# EAGLE design sensor-LCD-shield (EAGLE 5.06)
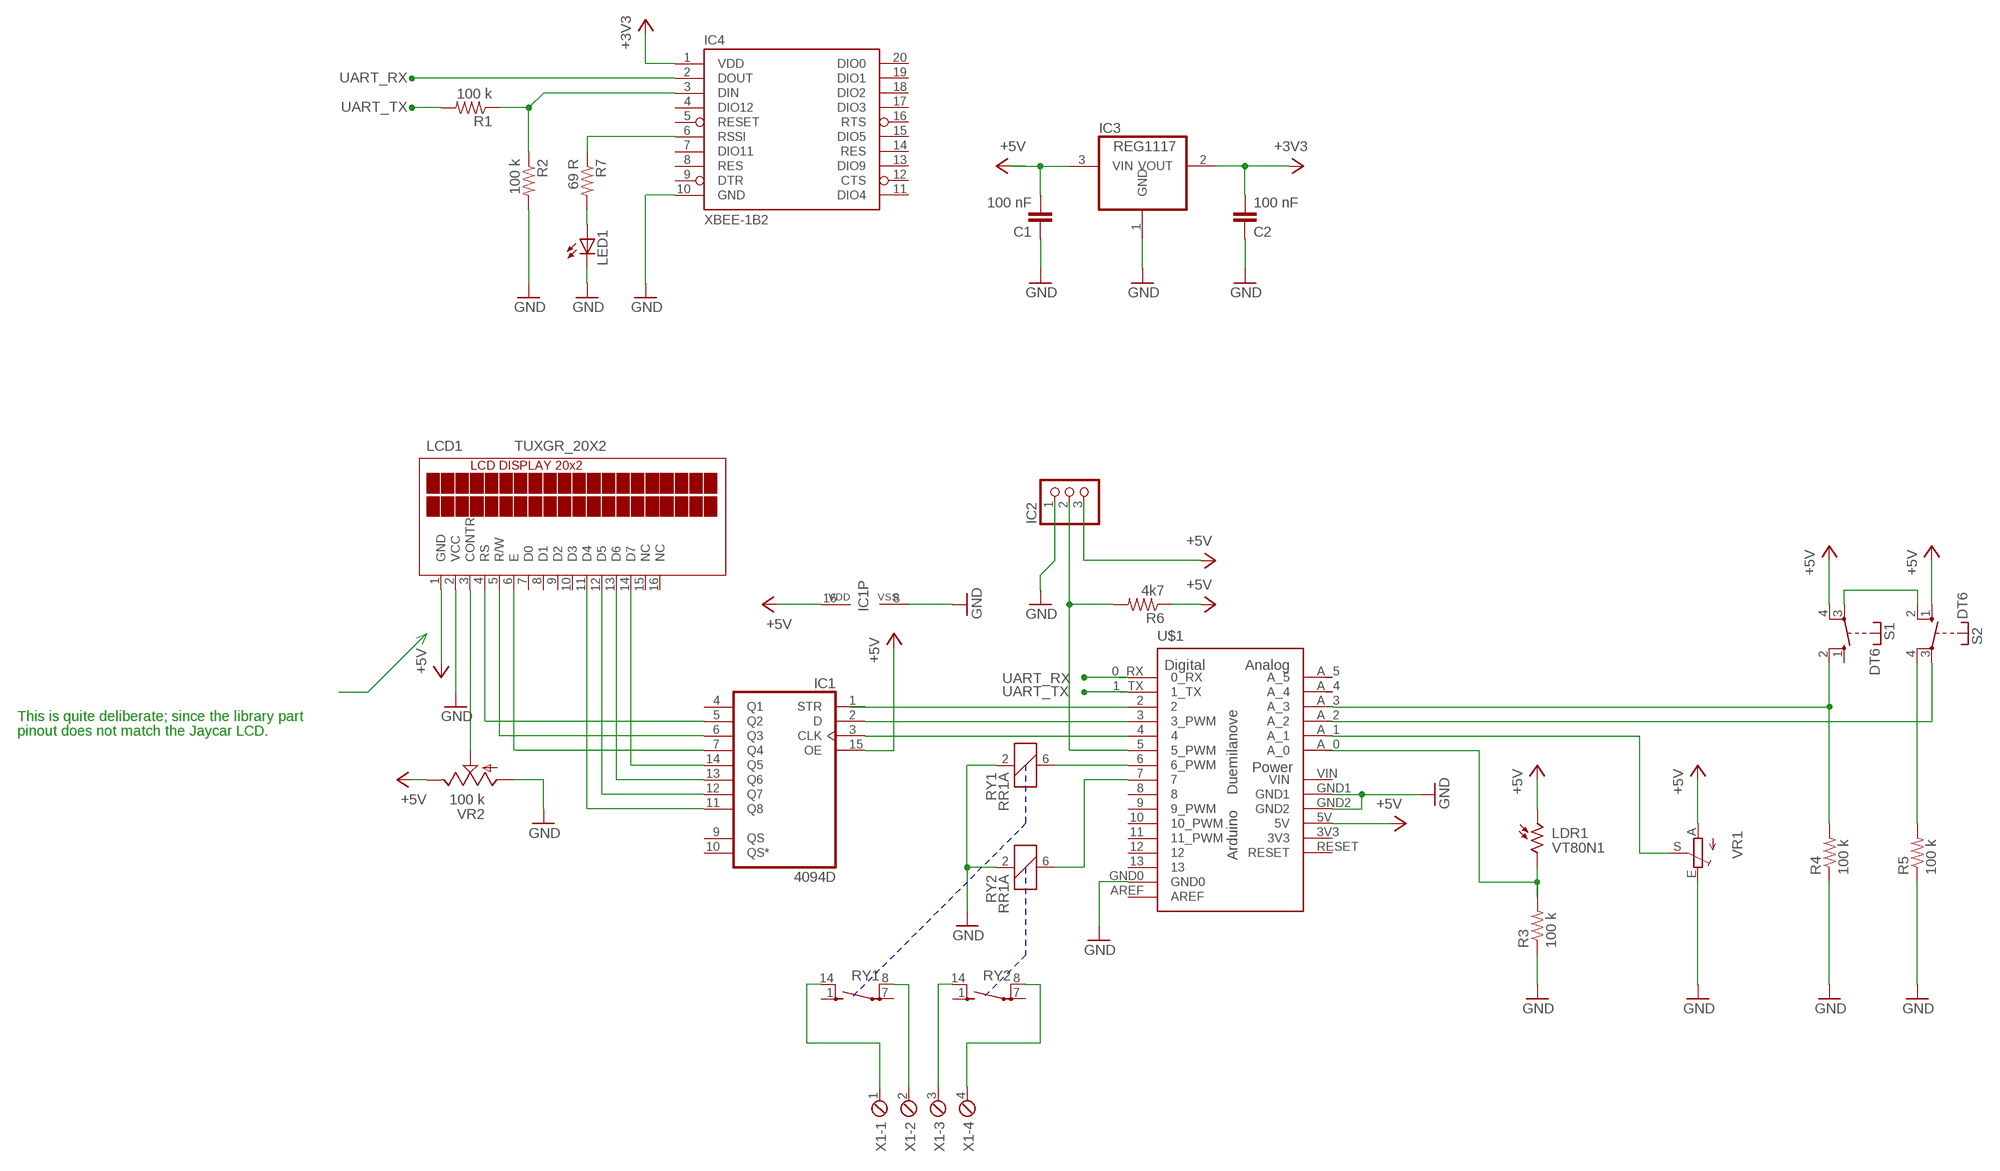
[diagram p0: schematic, sheet 1]

## Parts
C1  100 nF  C-EUC0805  [C0805]
C2  100 nF  C-EUC0805  [C0805]
IC1  4094D  [SO16]
IC2  PINHD-1X3  [1X03]
IC3  REG1117  [SOT223]
IC4  XBEE-1B2  [XBEE-SILK]
LCD1  TUXGR_20X2  [TUXGR_20X2]
LDR1  VT80N1  [VT800]
LED1  LED3MM  [LED3MM]
R1  100 k  R-US_R0805  [R0805]
R2  100 k  R-US_R0805  [R0805]
R3  100 k  R-US_R0805  [R0805]
R4  100 k  R-US_R0805  [R0805]
R5  100 k  R-US_R0805  [R0805]
R6  4k7  R-US_R0805  [R0805]
R7  69 R  R-US_R0805  [R0805]
RY1  RR1A  [RR1A]
RY2  RR1A  [RR1A]
S1  DT6  [DT6]
S2  DT6  [DT6]
U$1  ARDUINO-USBLONG_PADS_TEXT  [SHIELD]
VR1  TRIM_EU-B25V  [B25V]
VR2  100 k  TRIM_US-S64W  [S64W]
X1  MPT4  [4POL254]

## Nets
+3V3: C2.2 IC3.2(VOUT) IC4.1(VDD)
+5V: C1.2 IC1.15(OE) IC1.16(VDD) IC2.3 IC3.3(VIN) LCD1.1(GND) LDR1.1 R6.1 S1.4(P) S2.1(S) U$1.5V VR1.A VR2.E
GND: C1.1 C2.1 IC1.8(VSS) IC2.1 IC3.1(GND) IC4.10(GND) LCD1.2(VCC) LED1.K(C) R2.2 R3.1 R4.1 R5.1 RY1.2 RY2.2 U$1.GND0 U$1.GND1 U$1.GND2 VR1.E VR2.A
N$1: IC1.1(STR) U$1.2
N$2: IC1.3(CLK) U$1.4
N$3: IC1.2(D) U$1.3(3_PWM)
N$4: RY1.6 U$1.6(6_PWM)
N$5: RY2.6 U$1.7
N$6: RY1.14(2:S) X1.1
N$7: RY1.8(2:P) X1.2
N$9: RY2.8(2:P) X1.4
N$10: R4.2 S1.2(S) U$1.A_3
N$11: U$1.A_1 VR1.S
N$12: S2.3(P) U$1.A_2
N$13: LDR1.2 R3.2 U$1.A_0
N$14: IC1.11(Q8) LCD1.11(D4)
N$15: IC1.12(Q7) LCD1.12(D5)
N$16: IC1.13(Q6) LCD1.13(D6)
N$17: IC1.14(Q5) LCD1.14(D7)
N$18: IC1.5(Q2) LCD1.4(RS)
N$19: IC1.6(Q3) LCD1.5(R/W)
N$20: IC1.7(Q4) LCD1.6(E)
N$21: LCD1.3(CONTR) VR2.S
N$22: IC2.2 R6.2 U$1.5(5_PWM)
N$23: IC4.6(RSSI) R7.1
N$24: LED1.A R7.2
N$25: R5.2 S2.4(P)
N$26: IC4.3(DIN) R1.1 R2.1
N$27: S1.3(P) S2.2(S)
N$30: RY2.14(2:S) X1.3
UART_RX: IC4.2(DOUT) U$1.0_RX
UART_TX: R1.2 U$1.1_TX
Unconnected: IC1.4(Q1) IC1.9(QS) IC1.10(QS*) IC4.4(DIO12) IC4.5(RESET) IC4.7(DIO11) IC4.8(RES) IC4.9(DTR) IC4.11(DIO4) IC4.12(CTS) IC4.13(DIO9) IC4.14(RES) IC4.15(DIO5) IC4.16(RTS) IC4.17(DIO3) IC4.18(DIO2) IC4.19(DIO1) IC4.20(DIO0) LCD1.7(D0) LCD1.8(D1) LCD1.9(D2) LCD1.10(D3) LCD1.15(NC) LCD1.16(NC) RY1.1(2:S) RY1.7(2:P) RY2.1(2:S) RY2.7(2:P) S1.1(S) U$1.8 U$1.9(9_PWM) U$1.10(10_PWM) U$1.11(11_PWM) U$1.12 U$1.13 U$1.A_4 U$1.A_5 U$1.AREF U$1.RESET

## Buses
B$1
B$2

## Notes on the sheet
- This is quite deliberate; since the library part
- pinout does not match the Jaycar LCD.

## Power pins joined to a net without a drawn wire
3V3: U$1.3V3
VIN: U$1.VIN

## Library data of the parts
C1 C2 = rcl:C-EU: CAPACITOR, European symbol
IC1 = 40xx:4094: 8-stage SHIFT/STORE REGISTER, tri-state
IC2 = pinhead:PINHD-1X3: PIN HEADER
IC3 = burr-brown:REG1117: 800mA and 1A Low Dropout (LDO) Positive Regulator 1.8V, 2.5V, 2.85V, 3.3V, 5V, and Adj
IC4 = SparkFun:XBEE-1
LCD1 = display-lcd:TUXGR_20X2: Tuxgraphics LCD display 20x2 characters reflective, without background light Source: tuxgr_20x2.pdf
LDR1 = photo-elements:VT8: Photoconductive Cell VT800 Series Source: http://optoelectronics.perkinelmer.com/content/Datasheets/DTS_vt800seriesdatasheet.pdf
LED1 = led:LED: LED OSRAM: - CHIPLED LG R971, LG N971, LY N971, LG Q971, LY Q971, LO R971, LY R971 LH N974, LH R974 LS Q976, LO Q976, LY Q976 LO Q996 - Hyper CHIPLED LW Q18S LB Q993, LB Q99A, LB R99A - SideLED LS A670, LO A670, LY A670, LG A670, LP A670 LB A673, LV A673, LT A673, LW A673 LH A674 LY A675 LS A676, LA A676, LO A676, LY A676, LW A676 LS A679, LY A679, LG A679 - Hyper Micro SIDELED® LS Y876, LA Y876, LO Y876, LY Y876 LT Y87S - SmartLED LW L88C, LW L88S LB L89C, LB L89S, LG L890 LS L89K, LO L89K, LY L89K LS L896, LA L896, LO L896, LY L896 - TOPLED LS T670, LO T670, LY T670, LG T670, LP T670 LSG T670, LSP T670, LSY T670, LOP T670, LYG T670 LG T671, LOG T671, LSG T671 LB T673, LV T673, LT T673, LW T673 LH T674 LS T676, LA T676, LO T676, LY T676, LB T676, LH T676, LSB T676, LW T676 LB T67C, LV T67C, LT T67C, LS T67K, LO T67K, LY T67K, LW E67C LS E67B, LA E67B, LO E67B, LY E67B, LB E67C, LV E67C, LT E67C LW T67C LS T679, LY T679, LG T679 LS T770, LO T770, LY T770, LG T770, LP T770 LB T773, LV T773, LT T773, LW T773 LH T774 LS E675, LA E675, LY E675, LS T675 LS T776, LA T776, LO T776, LY T776, LB T776 LHGB T686 LT T68C, LB T68C - Hyper Mini TOPLED® LB M676 - Mini TOPLED Santana® LG M470 LS M47K, LO M47K, LY M47K Source: http://www.osram.convergy.de LUXEON: - LUMILED® LXK2-PW12-R00, LXK2-PW12-S00, LXK2-PW14-U00, LXK2-PW14-V00 LXK2-PM12-R00, LXK2-PM12-S00, LXK2-PM14-U00 LXK2-PE12-Q00, LXK2-PE12-R00, LXK2-PE12-S00, LXK2-PE14-T00, LXK2-PE14-U00 LXK2-PB12-K00, LXK2-PB12-L00, LXK2-PB12-M00, LXK2-PB14-N00, LXK2-PB14-P00, LXK2-PB14-Q00 LXK2-PR12-L00, LXK2-PR12-M00, LXK2-PR14-Q00, LXK2-PR14-R00 LXK2-PD12-Q00, LXK2-PD12-R00, LXK2-PD12-S00 LXK2-PH12-R00, LXK2-PH12-S00 LXK2-PL12-P00, LXK2-PL12-Q00, LXK2-PL12-R00 Source: www.luxeon.com KINGBRIGHT: KA-3528ASYC Source: www.kingbright.com
R1-R7 = rcl:R-US_: RESISTOR, American symbol
RY1 RY2 = relay:RR1A: RELAY reed, polarity, 1 x norm. open with shield
S1 S2 = switch-misc:DT: ITT SWITCH
U$1 = Arduino-Various:ARDUINO-USB: The Ardiuno Duemilanove Pinouts layoutet as a Bare Shield. v0.5 Also for Arduino Diecimila. This is designed as a Part and has no Outline in the Dimension Layer. The Outline, when present, is drawed at the tPlace / bPlace Layer. Library by Stephanie Lange, http://www.k-ita.de/~sl/
VR1 = pot:TRIM_EU-: POTENTIOMETER
VR2 = pot:TRIM_US-: POTENTIOMETER
X1 = con-phoenix-254:MPT4: PHOENIX CONNECTOR

## Board
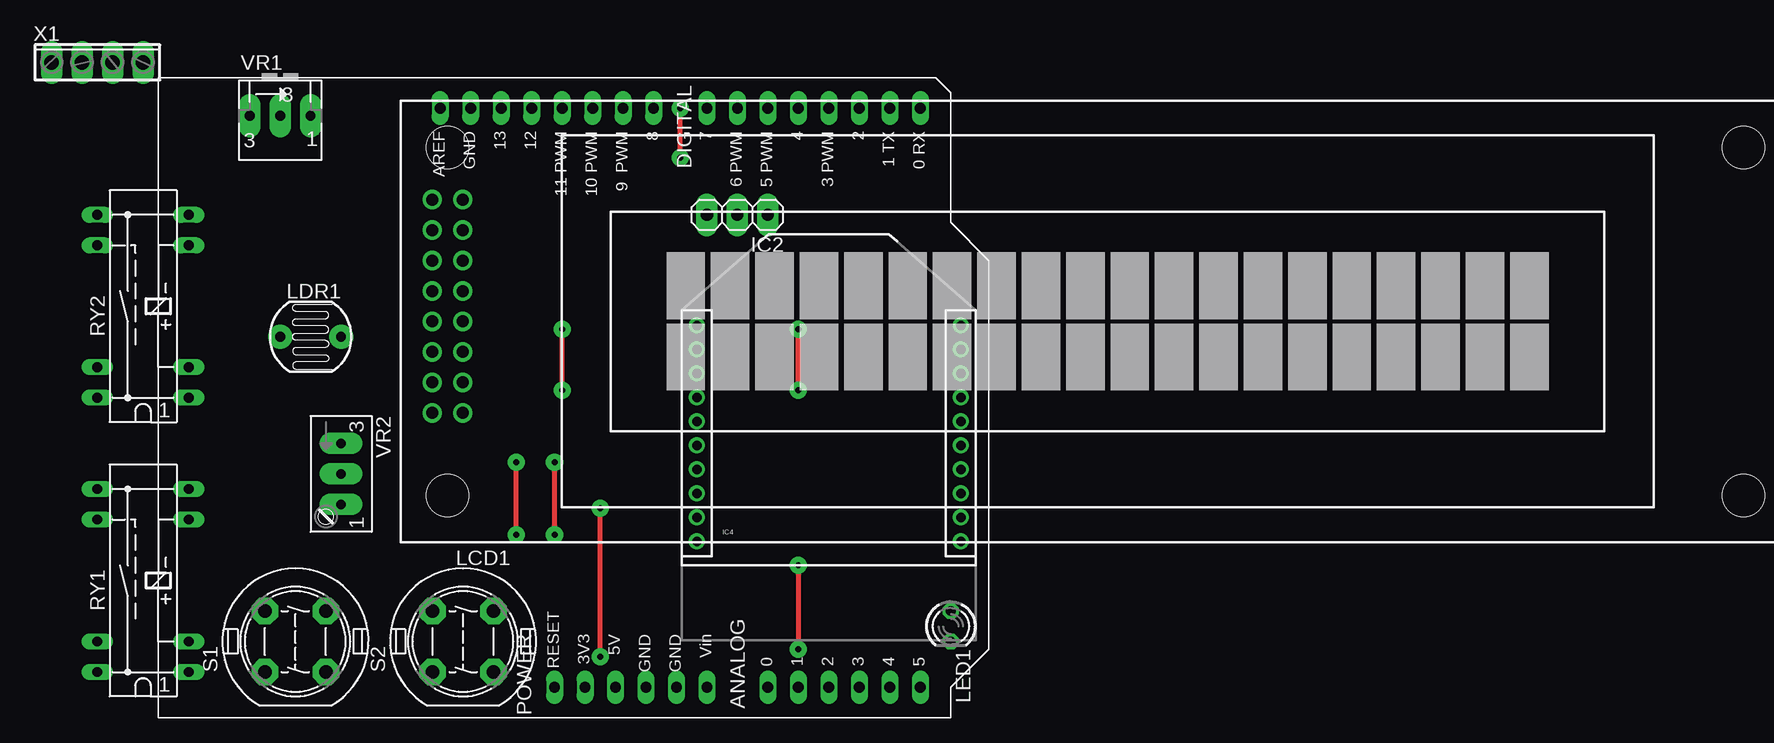
[diagram p1: board, top side]
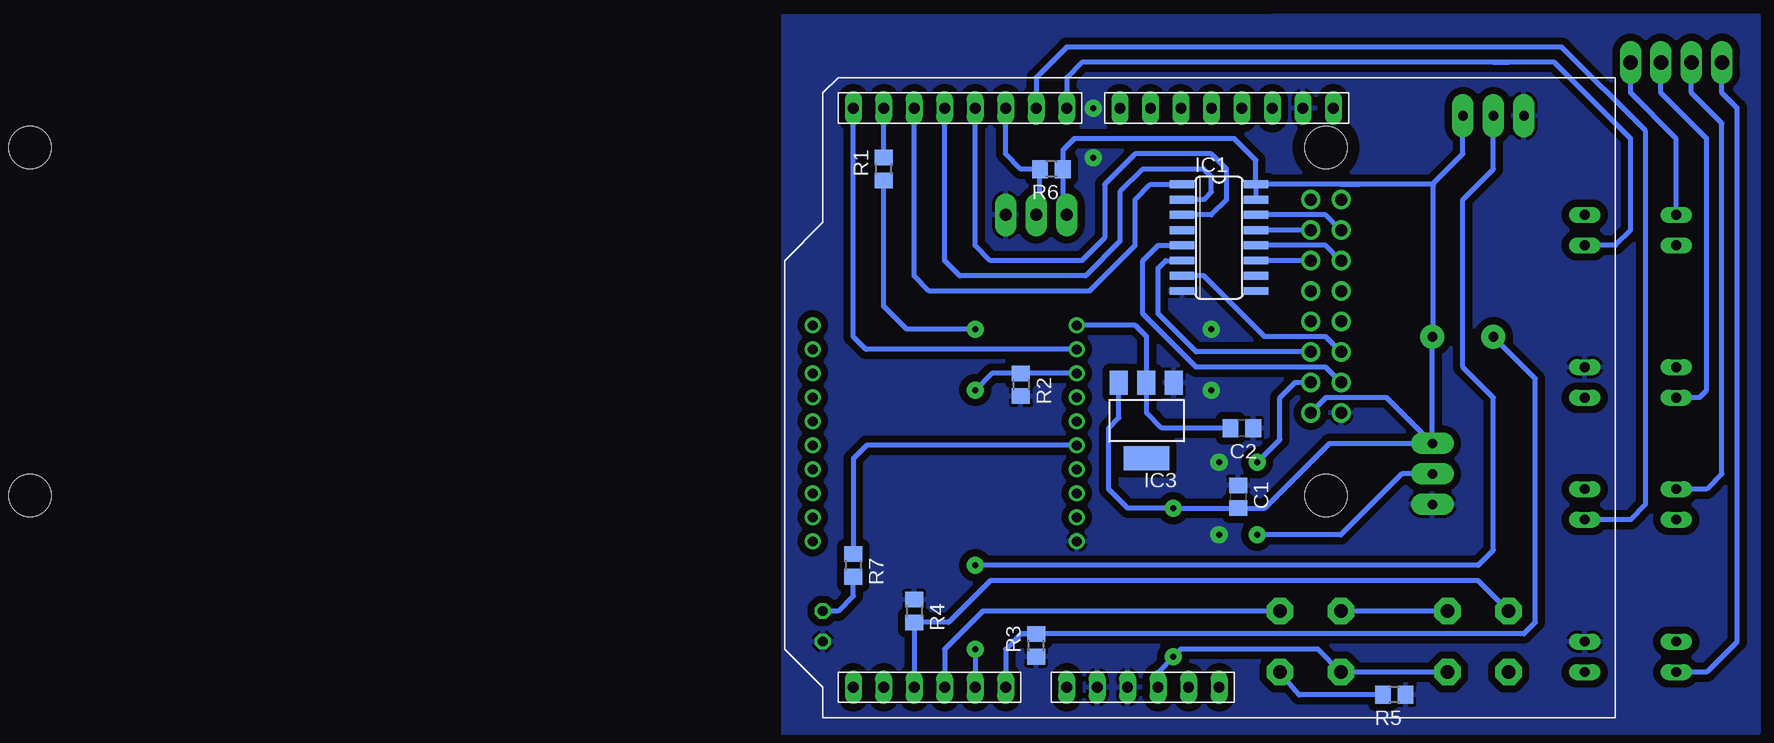
[diagram p2: board, bottom side, seen from below]

No outline drawn. Coordinates in mm, seen from the top.
Copper layers (1*16): Top 0.035mm / dielectric 1.5mm / Bottom 0.035mm
Design rules "default": minimum track width 10mil, minimum drill 24mil, track to track 8mil, track to pad 8mil, pad to pad 8mil, via to via 8mil, smd to smd 8mil, copper to edge 40mil, drill to drill 8mil, minimum pad ring 10mil, minimum via ring 8mil, stop-mask expansion 4mil, vias tented up to drill 0mil, thermal gap 10mil

### Footprints (pad centres in the part's own frame; a part is rotated, then mirrored left to right if it is on the bottom)
C0805 = smd 1.3 x 1.5: 1 -0.95,0; 2 0.95,0
SO16 = smd 0.66 x 2.032: 1 -4.445,-3.073; 2 -3.175,-3.073; 3 -1.905,-3.073; 4 -0.635,-3.073; 5 0.635,-3.073; 6 1.905,-3.073; 7 3.175,-3.073; 8 4.445,-3.073; 9 4.445,3.073; 10 3.175,3.073; 11 1.905,3.073; 12 0.635,3.073; 13 -0.635,3.073; 14 -1.905,3.073; 15 -3.175,3.073; 16 -4.445,3.073
1X03 = drill 1.016 pad 1.8 long: 1 -2.54,0; 2 0,0; 3 2.54,0
SOT223 = smd 1.499 x 2.007: 1 -2.261,-3.15; 2 0.025,-3.15; 3 2.311,-3.15 | smd 3.81 x 2.007: 4 0,3.15
XBEE-SILK = drill 0.8 round: 1 -11,20; 2 -11,18; 3 -11,16; 4 -11,14; 5 -11,12; 6 -11,10; 7 -11,8; 8 -11,6; 9 -11,4; 10 -11,2; 11 11,2; 12 11,4; 13 11,6; 14 11,8; 15 11,10; 16 11,12; 17 11,14; 18 11,16; 19 11,18; 20 11,20
TUXGR_20X2 = drill 1 pad 1.6 round: 1 -52.73,-7.62; 2 -55.27,-7.62; 3 -52.73,-5.08; 4 -55.27,-5.08; 5 -52.73,-2.54; 6 -55.27,-2.54; 7 -52.73,0; 8 -55.27,0; 9 -52.73,2.54; 10 -55.27,2.54; 11 -52.73,5.08; 12 -55.27,5.08; 13 -52.73,7.62; 14 -55.27,7.62; 15 -52.73,10.16; 16 -55.27,10.16 | hole 3.5: -54,-14.5; 54,-14.5; -54,14.5; 54,14.5
VT800 = drill 0.8 pad 2 round: 1 -2.54,0; 2 2.54,0
LED3MM = drill 0.813 octagon: A -1.27,0; K 1.27,0
R0805 = smd 1.3 x 1.5: 1 -0.95,0; 2 0.95,0
RR1A = drill 0.813 long: 1 -7.62,-3.81; 2 -5.08,-3.81; 6 5.08,-3.81; 7 7.62,-3.81; 8 7.62,3.81; 9 5.08,3.81; 13 -5.08,3.81; 14 -7.62,3.81
DT6 = drill 1.118 pad 2.2 octagon: 1 -2.54,2.54; 2 2.54,2.54; 3 2.54,-2.54; 4 -2.54,-2.54
SHIELD = drill 0.9 pad 1.27 long: 0_RX -25.4,27.94; 1_TX -25.4,25.4; 2 -25.4,22.86; 3 -25.4,20.32; 3V3 22.86,0; 4 -25.4,17.78; 5 -25.4,15.24; 5V 22.86,2.54; 6 -25.4,12.7; 7 -25.4,10.16; 8 -25.4,5.715; 9 -25.4,3.175; 10 -25.4,0.635; 11 -25.4,-1.905; 12 -25.4,-4.445; 13 -25.4,-6.985; A_0 22.86,15.24; A_1 22.86,17.78; A_2 22.86,20.32; A_3 22.86,22.86; A_4 22.86,25.4; A_5 22.86,27.94; AREF -25.4,-12.065; GND0 -25.4,-9.525; GND1 22.86,7.62; GND2 22.86,5.08; RESET 22.86,-2.54; VIN 22.86,10.16
B25V = drill 0.8 pad 1.8 long: A 2.54,0.635; E -2.54,0.635; S 0,0.635
S64W = drill 0.8 pad 1.8 long: A 2.54,1.27; E -2.54,1.27; S 0,1.27
4POL254 = drill 1.2 long: 1 -3.81,0; 2 -1.27,0; 3 1.27,0; 4 3.81,0

### Placement (x,y rotation side)
C1  59.37,22.23 270 bottom
C2  59.05,27.94 180 bottom
IC1  60.96,43.81 270 bottom
IC2  76.2,45.72 180 top
IC3  66.99,28.57 180 bottom
IC4  83.82,16.51 0 top
LCD1  106.05,36.83 0 top
LDR1  40.64,35.56 180 top
LED1  93.98,11.43 270 top
R1  88.9,49.53 90 bottom
R2  77.47,31.56 270 bottom
R3  76.2,9.84 90 bottom
R4  86.36,12.7 270 bottom
R5  46.35,5.71 180 bottom
R6  74.93,49.53 180 bottom
R7  91.44,16.51 270 bottom
RY1  26.67,15.24 90 top
RY2  26.67,38.1 90 top
S1  39.37,10.16 90 top
S2  53.34,10.16 90 top
U$1  63.5,29.21 270 top
VR1  38.1,53.34 0 top
VR2  41.91,24.13 270 top
X1  22.86,58.42 0 top

### Tracks (layer width: path | path; a pad name or v marks a point on that pad's centre or on a via)
+3V3
  Bottom 0.406: IC4.1 67.94,36.51 66.99,35.56 66.99,31.75 IC3.2 66.99,31.7 66.99,29.21 65.72,27.94 C2.2
+5V  (via drill 0.5 pad 1.42)
  Top 0.406: v64.77,8.89 v64.77,21.27
  Bottom 0.406: IC1.16 IC1.15 IC1.16 | IC1.16 57.89,50.27 59.69,52.07 73.03,52.07 73.98,51.12 R6.1 73.98,47.31 73.66,46.99 IC2.3 | S1.4 S2.1 52.7,9.53 64.14,9.53 v64.77,8.89 66.04,7.62 U$1.5V | VR2.E LDR1.1 43.1,35.64 43.1,48.18 43.18,48.26 | 60.01,21.27 v64.77,21.27 68.58,21.27 70.17,22.86 70.17,27.94 69.3,28.8 IC3.3 | VR2.E 51.75,26.67 57.15,21.27 60.01,21.27 | 60.01,21.27 C1.2 | 50.8,48.26 49.3,48.26 | 50.8,48.26 IC1.16 | VR2.E 46.99,30.48 52.07,30.48 53.31,29.23 LCD1.1 | VR1.A 40.64,50.8 43.18,48.26 | 43.18,48.26 50.8,48.26
GND  (via drill 0.5 pad 1.42)
  Top 0.406: v61.59,31.11 v61.59,36.2 | v71.44,50.48 v71.44,54.61 | v60.96,19.05 v60.96,25.08
  pour Bottom (isolate 0.61): 16,62.29 97.28,62.23 97.28,2.54 16,2.6
N$1
  Bottom 0.406: IC1.1 66.67,48.26 67.94,46.99 67.94,43.18 71.75,39.37 85.09,39.37 86.36,40.64 U$1.2
N$2
  Bottom 0.406: U$1.4 81.28,43.18 80.01,41.91 72.39,41.91 70.48,43.81 70.48,48.26 67.94,50.8 61.59,50.8 60.33,49.53 60.33,46.99 61.59,45.72 IC1.3
N$3
  Bottom 0.406: IC1.2 62.23,46.99 61.59,47.62 61.59,48.9 62.23,49.53 67.31,49.53 69.22,47.62 69.22,43.5 72.07,40.64 82.55,40.64 83.82,41.91 U$1.3
N$4
  Bottom 0.406: U$1.6 76.2,57.15 73.66,59.69 32.38,59.69 25.4,52.7 25.4,21.59 26.67,20.32 RY1.6
N$5
  Bottom 0.406: U$1.7 73.66,57.15 72.39,58.42 38.1,58.42 | 38.1,58.42 36.83,58.42 | RY2.6 27.94,43.18 26.67,44.45 26.67,52.07 33.02,58.42 38.1,58.42
N$6
  Bottom 0.406: RY1.14 20.32,7.62 17.78,10.16 17.78,54.61 19.05,55.88 X1.1
N$7
  Bottom 0.406: X1.2 21.59,55.88 19.05,53.34 19.05,24.13 20.32,22.86 RY1.8
N$8  (via drill 0.5 pad 1.42)
  other vias: 81.28,9.53
N$9
  Bottom 0.406: RY2.8 22.86,52.07 26.67,55.88 X1.4
N$10
  Bottom 0.406: S1.2 39.37,15.24 80.01,15.24 83.5,11.75 R4.2 | R4.2 | R4.2 U$1.A_3
N$11  (via drill 0.5 pad 1.42)
  Top 0.406: v81.28,16.51 v81.28,9.53
  Bottom 0.406: v81.28,16.51 39.37,16.51 38.1,17.78 38.1,30.48 40.64,33.02 40.64,46.99 38.1,49.53 VR1.S | v81.28,9.53 U$1.A_1
N$12
  Bottom 0.406: U$1.A_2 83.82,9.53 80.64,12.7 S2.3
N$13
  Bottom 0.406: U$1.A_0 78.74,9.53 77.47,10.79 | 77.47,10.79 35.56,10.79 34.61,11.75 34.61,32.07 LDR1.2 | 77.47,10.79 R3.2
N$14
  Bottom 0.406: LCD1.11 IC1.11
N$15
  Bottom 0.406: LCD1.12 50.8,41.91 52.07,43.18 IC1.12
N$16
  Bottom 0.406: LCD1.13 IC1.13
N$17
  Bottom 0.406: LCD1.14 50.8,44.45 52.07,45.72 IC1.14
N$18
  Bottom 0.406: IC1.5 66.04,43.18 67.31,41.91 67.31,37.47 62.87,33.02 52.07,33.02 50.8,31.75 LCD1.4
N$19
  Bottom 0.406: LCD1.5 62.87,34.29 66.04,37.47 66.04,41.27 65.41,41.91 IC1.6
N$20
  Bottom 0.406: IC1.7 62.23,40.64 57.15,35.56 52.07,35.56 50.8,34.29 LCD1.6
N$21  (via drill 0.5 pad 1.42)
  Top 0.406: v57.78,19.05 v57.78,25.08
  Bottom 0.406: LCD1.3 54.61,31.75 55.88,30.48 55.88,26.99 v57.78,25.08 | v57.78,19.05 50.8,19.05 45.72,24.13 VR2.S
N$22
  Bottom 0.406: IC2.2 76.2,46.99 75.88,47.31 R6.2 77.47,49.53 78.74,50.8 U$1.5
N$23
  Bottom 0.406: IC4.6 90.33,26.51 91.44,25.4 R7.1
N$24
  Bottom 0.406: LED1.A 92.71,12.7 91.44,13.97 R7.2
N$25
  Bottom 0.406: R5.2 54.29,5.71 S2.4
N$26  (via drill 0.5 pad 1.42)
  Top 0.406: v81.28,31.11 v81.28,36.2
  Bottom 0.406: R1.1 88.9,38.1 87,36.2 v81.28,36.2 | IC4.3 R2.1 79.89,32.51 v81.28,31.11
N$27
  Bottom 0.406: S1.3 S2.2
N$28  (via drill 0.5 pad 1.42)
  other vias: 81.28,36.2
N$30
  Bottom 0.406: X1.3 24.13,55.88 20.32,52.07 20.32,31.11 20.95,30.48 RY2.14
N$31  (via drill 0.5 pad 1.42)
  other vias: 57.78,19.05
UART_RX
  Bottom 0.406: IC4.2 90.39,34.51 91.44,35.56 U$1.0_RX
UART_TX
  Bottom 0.406: R1.2 U$1.1_TX